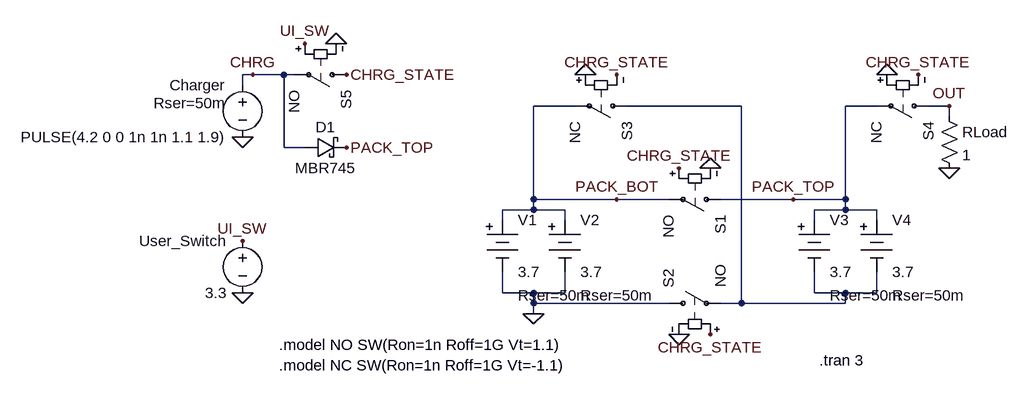
[diagram p0: schematic Battery_Pack_Rearrangement_w_Charger.asc]
Battery_Pack_Rearrangement_w_Charger.asc, the LTspice schematic file:
Version 4
SHEET 1 972 680
WIRE -208 -160 -224 -160
WIRE -160 -160 -208 -160
WIRE -144 -160 -160 -160
WIRE -224 -144 -224 -160
WIRE 288 -112 224 -112
WIRE 544 -112 368 -112
WIRE 752 -112 704 -112
WIRE 864 -112 832 -112
WIRE 864 -96 864 -112
WIRE -160 -48 -160 -160
WIRE -128 -48 -160 -48
WIRE 224 32 224 -112
WIRE 352 32 224 32
WIRE 432 32 352 32
WIRE 624 32 512 32
WIRE 704 32 704 -112
WIRE 704 32 624 32
WIRE 224 48 224 32
WIRE 224 48 176 48
WIRE 272 48 224 48
WIRE 704 48 704 32
WIRE 704 48 656 48
WIRE 752 48 704 48
WIRE 176 64 176 48
WIRE 272 64 272 48
WIRE 656 64 656 48
WIRE 752 64 752 48
WIRE 176 176 176 144
WIRE 224 176 176 176
WIRE 272 176 272 144
WIRE 272 176 224 176
WIRE 656 176 656 144
WIRE 704 176 656 176
WIRE 752 176 752 144
WIRE 752 176 704 176
WIRE 224 192 224 176
WIRE 432 192 224 192
WIRE 544 192 544 -112
WIRE 544 192 512 192
WIRE 704 192 704 176
WIRE 704 192 544 192
WIRE 224 208 224 192
FLAG 224 208 0
FLAG 448 240 0
FLAG 496 -16 0
FLAG 304 -160 0
FLAG 768 -160 0
FLAG 864 -16 0
FLAG -224 176 0
FLAG -224 96 UI_SW
FLAG 624 32 PACK_TOP
FLAG 352 32 PACK_BOT
FLAG 864 -112 OUT
FLAG -224 -64 0
FLAG -80 -208 0
FLAG -128 -208 UI_SW
FLAG -64 -160 CHRG_STATE
FLAG 352 -160 CHRG_STATE
FLAG 448 -16 CHRG_STATE
FLAG 496 240 CHRG_STATE
FLAG 816 -160 CHRG_STATE
FLAG -208 -160 CHRG
FLAG -64 -48 PACK_TOP
SYMBOL Misc\\battery 176 48 R0
WINDOW 123 0 0 Left 2
WINDOW 39 24 132 Left 2
SYMATTR SpiceLine Rser=50m
SYMATTR InstName V1
SYMATTR Value 3.7
SYMBOL Misc\\battery 272 48 R0
WINDOW 123 0 0 Left 2
WINDOW 39 24 132 Left 2
SYMATTR SpiceLine Rser=50m
SYMATTR InstName V2
SYMATTR Value 3.7
SYMBOL Misc\\battery 656 48 R0
WINDOW 123 0 0 Left 2
WINDOW 39 24 132 Left 2
SYMATTR SpiceLine Rser=50m
SYMATTR InstName V3
SYMATTR Value 3.7
SYMBOL Misc\\battery 752 48 R0
WINDOW 123 0 0 Left 2
WINDOW 39 24 132 Left 2
SYMATTR SpiceLine Rser=50m
SYMATTR InstName V4
SYMATTR Value 3.7
SYMBOL sw 528 32 R90
SYMATTR InstName S1
SYMATTR Value NO
SYMBOL sw 416 192 R270
SYMATTR InstName S2
SYMATTR Value NO
SYMBOL sw 384 -112 R90
SYMATTR InstName S3
SYMATTR Value NC
SYMBOL sw 848 -112 R90
SYMATTR InstName S4
SYMATTR Value NC
SYMBOL res 848 -112 R0
SYMATTR InstName RLoad
SYMATTR Value 1
SYMBOL voltage -224 80 M0
WINDOW 123 0 0 Left 2
WINDOW 39 0 0 Left 2
SYMATTR InstName User_Switch
SYMATTR Value 3.3
SYMBOL sw -48 -160 R90
SYMATTR InstName S5
SYMATTR Value NO
SYMBOL voltage -224 -160 M0
WINDOW 123 0 0 Left 2
WINDOW 39 24 44 Left 2
SYMATTR InstName Charger
SYMATTR Value PULSE(4.2 0 0 1n 1n 1.1 1.9)
SYMATTR SpiceLine Rser=50m
SYMBOL schottky -128 -32 R270
WINDOW 0 32 32 VTop 2
WINDOW 3 0 32 VBottom 2
SYMATTR InstName D1
SYMATTR Value MBR745
SYMATTR Description Diode
SYMATTR Type diode
TEXT -168 256 Left 2 !.model NO SW(Ron=1n Roff=1G Vt=1.1)\n.model NC SW(Ron=1n Roff=1G Vt=-1.1)
TEXT 664 280 Left 2 !.tran 3

The netlist it stands for:
* Battery_Pack_Rearrangement_w_Charger.asc
V1 PACK_BOT 0 3.7 Rser=50m
V2 PACK_BOT 0 3.7 Rser=50m
V3 PACK_TOP N001 3.7 Rser=50m
V4 PACK_TOP N001 3.7 Rser=50m
S1 PACK_TOP PACK_BOT CHRG_STATE 0 NO
S2 0 N001 CHRG_STATE 0 NO
S3 N001 PACK_BOT 0 CHRG_STATE NC
S4 OUT PACK_TOP 0 CHRG_STATE NC
RLoad OUT 0 1
V§User_Switch UI_SW 0 3.3
S5 CHRG_STATE CHRG UI_SW 0 NO
V§Charger CHRG 0 PULSE(4.2 0 0 1n 1n 1.1 1.9) Rser=50m
D1 CHRG PACK_TOP MBR745
.model D D
.lib standard.dio
.model NO SW(Ron=1n Roff=1G Vt=1.1)
.model NC SW(Ron=1n Roff=1G Vt=-1.1)
.tran 3
.backanno
.end